# EAGLE design BusPirate-Breakout (EAGLE 5.10)
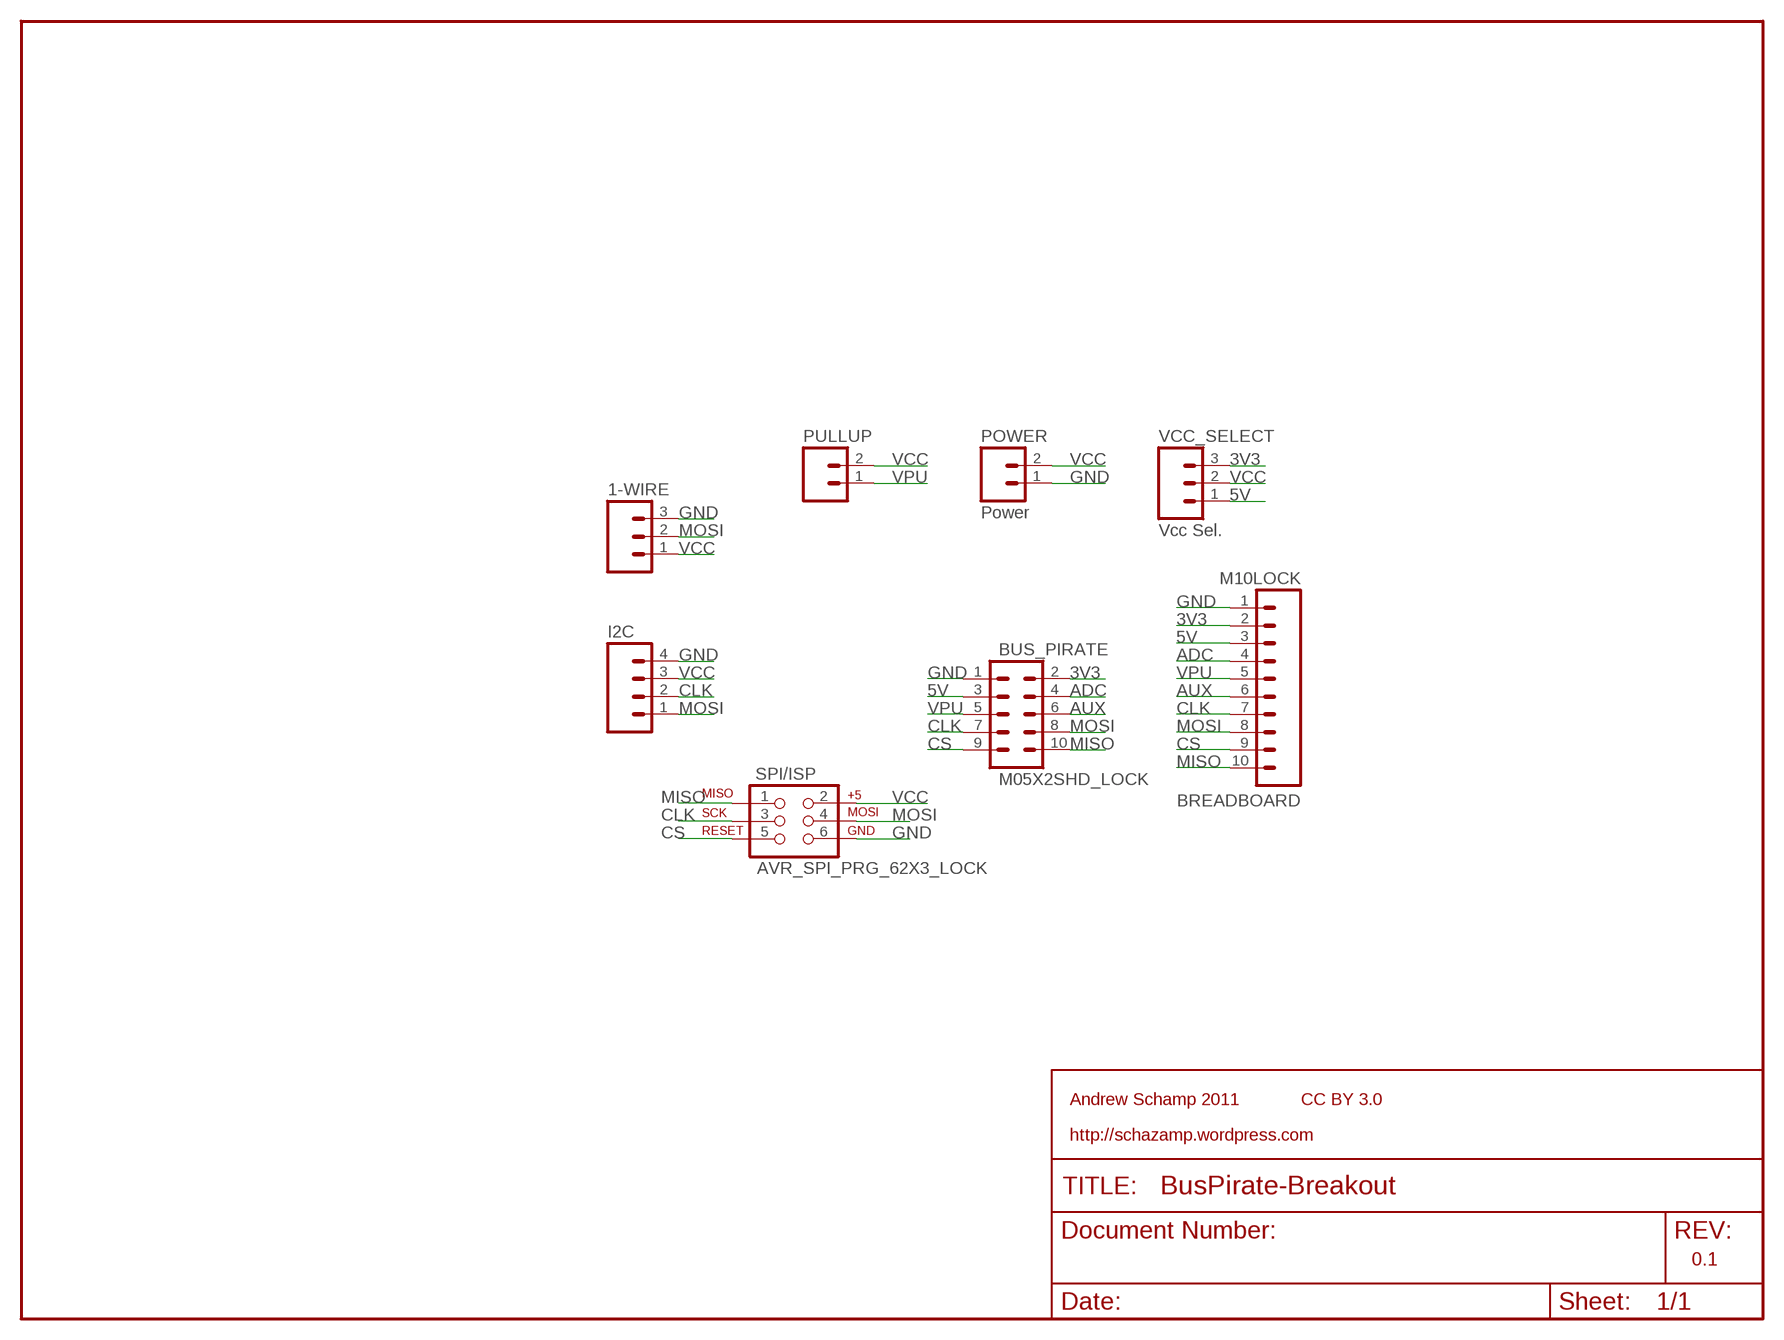
[diagram p0: schematic, sheet 1]

## Parts
1-WIRE  M03LOCK  [1X03_LOCK]
BREADBOARD  M10LOCK  [1X10_LOCK]
BUS_PIRATE  M05X2SHD_LOCK  [2X5-LOCK]
I2C  M04LOCK  [1X04_LOCK]
POWER  Power  M02LOCK  [1X02_LOCK]
PULLUP  M02LOCK  [1X02_LOCK]
SPI/ISP  AVR_SPI_PRG_62X3_LOCK  [2X3_LOCK]
VCC_SELECT  Vcc Sel.  M03LOCK  [1X03_LOCK]

## Nets
3V3: BREADBOARD.2 BUS_PIRATE.2 VCC_SELECT.3
5V: BREADBOARD.3 BUS_PIRATE.3 VCC_SELECT.1
ADC: BREADBOARD.4 BUS_PIRATE.4
AUX: BREADBOARD.6 BUS_PIRATE.6
CLK: BREADBOARD.7 BUS_PIRATE.7 I2C.2 SPI/ISP.3
CS: BREADBOARD.9 BUS_PIRATE.9 SPI/ISP.5
GND: 1-WIRE.3 BREADBOARD.1 BUS_PIRATE.1 I2C.4 POWER.1 SPI/ISP.6
MISO: BREADBOARD.10 BUS_PIRATE.10 SPI/ISP.1
MOSI: 1-WIRE.2 BREADBOARD.8 BUS_PIRATE.8 I2C.1 SPI/ISP.4
VCC: 1-WIRE.1 I2C.3 POWER.2 PULLUP.2 SPI/ISP.2 VCC_SELECT.2
VPU: BREADBOARD.5 BUS_PIRATE.5 PULLUP.1

## Notes on the sheet
- Andrew Schamp 2011 | CC BY 3.0
- http://schazamp.wordpress.com
- 0.1

## Library data of the parts
1-WIRE VCC_SELECT = SparkFun:M03: Header 3 Standard 3-pin 0.1" header. Use with straight break away headers (SKU : PRT-00116), right angle break away headers (PRT-00553), swiss pins (PRT-00743), machine pins (PRT-00117), and female headers (PRT-00115). Molex polarized connector foot print use with SKU : PRT-08232 with associated crimp pins and housings.
BREADBOARD = SparkFun:M10: Header 10 Standard 10-pin 0.1" header. Use with straight break away headers (SKU : PRT-00116), right angle break away headers (PRT-00553), swiss pins (PRT-00743), machine pins (PRT-00117), and female headers (PRT-00115).
BUS_PIRATE = ideabot:M05X2: Header 5x2 Standard 10-pin dual row 0.1" header. Commonly used with AVR-ISP. Use with Spark Fun Electronics SKU: PRT-00778
I2C = SparkFun:M04: Header 4 Standard 4-pin 0.1" header. Use with straight break away headers (SKU : PRT-00116), right angle break away headers (PRT-00553), swiss pins (PRT-00743), machine pins (PRT-00117), and female headers (PRT-00115). Molex polarized connector foot print use with SKU : PRT-08231 with associated crimp pins and housings.
POWER PULLUP = SparkFun:M02: Header 2 Standard 2-pin 0.1" header. Use with straight break away headers (SKU : PRT-00116), right angle break away headers (PRT-00553), swiss pins (PRT-00743), machine pins (PRT-00117), and female headers (PRT-00115). Molex polarized connector foot print use with SKU : PRT-08233 with associated crimp pins and housings.
SPI/ISP = SparkFun:AVR_SPI_PRG_6: AVR ISP 6 Pin This is the reduced ISP connector for AVR programming. Common on Arduino. This footprint will take up less PCB space and can be used with a 10-pin to 6-pin adapter such as SKU: BOB-08508

## Board
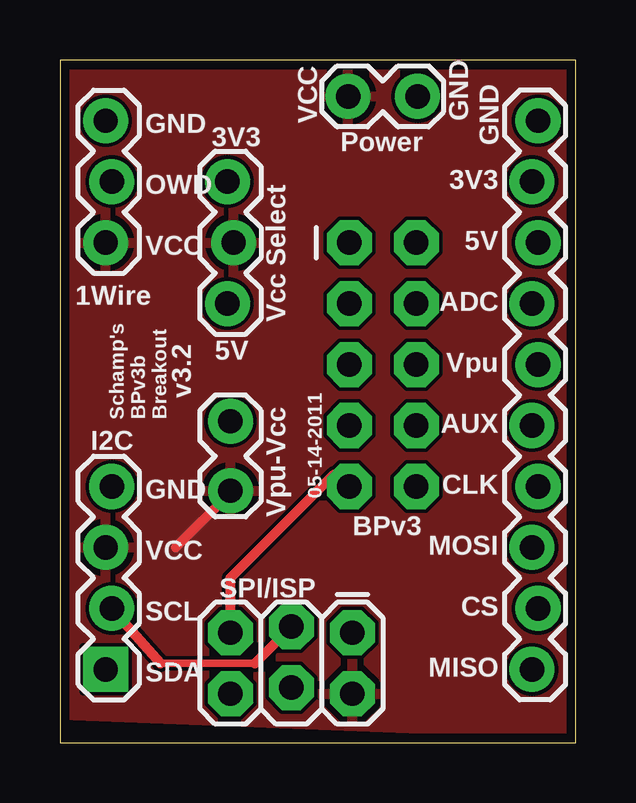
[diagram p1: board, top side]
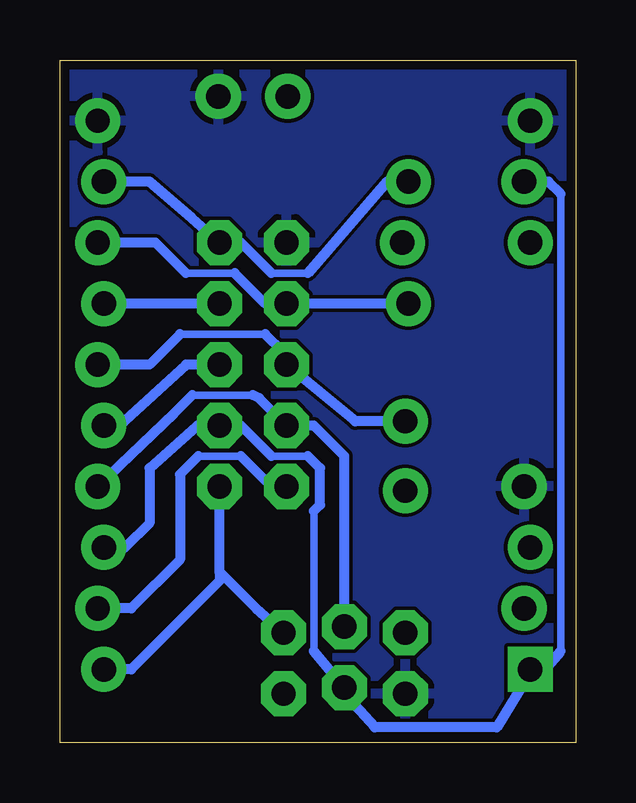
[diagram p2: board, bottom side, seen from below]

Size 21.51 x 28.44 mm. Coordinates in mm from the lower left corner, seen from the top.
Outline: 0,0 21.51,0 21.51,28.44 0,28.44 0,0
Copper layers (1*16): Top 0.0356mm / dielectric 1.5011mm / Bottom 0.0356mm
Design rules "LaenPCBOrder": minimum track width 6mil, minimum drill 13mil, track to track 6mil, track to pad 6mil, pad to pad 6mil, via to via 6mil, smd to smd 6mil, copper to edge 15mil, drill to drill 6mil, minimum pad ring 7mil, minimum via ring 7mil, stop-mask expansion 4mil, vias tented up to drill 0mil, thermal gap 10mil

### Footprints (pad centres in the part's own frame; a part is rotated, then mirrored left to right if it is on the bottom)
1X03_LOCK = drill 1.016 pad 1.88 round: 1 0,0.127; 2 2.54,-0.127; 3 5.08,0.127
1X10_LOCK = drill 1.016 pad 1.88 round: 1 0,0.127; 2 2.54,-0.127; 3 5.08,0.127; 4 7.62,-0.127; 5 10.16,0.127; 6 12.7,-0.127; 7 15.24,0.127; 8 17.78,-0.127; 9 20.32,0.127; 10 22.86,-0.127
2X5-LOCK = drill 1.016 pad 1.88 octagon: 1 -1.397,5.08; 2 1.397,5.08; 3 -1.397,2.54; 4 1.397,2.54; 5 -1.397,0; 6 1.397,0; 7 -1.397,-2.54; 8 1.397,-2.54; 9 -1.397,-5.08; 10 1.397,-5.08
1X04_LOCK = drill 1.016 pad 1.88 square: 1 0,0.127 | drill 1.016 pad 1.88 round: 2 2.54,-0.127; 3 5.08,0.127; 4 7.62,-0.127
1X02_LOCK = drill 1.016 pad 1.88 round: 1 -0.178,0; 2 2.718,0
2X3_LOCK = drill 1.016 pad 1.88 octagon: 1 0,0; 2 0,2.54; 3 2.54,-0.254; 4 2.54,2.286; 5 5.08,0; 6 5.08,2.54

### Placement (x,y rotation side)
1-WIRE  2.03,20.83 90 top
BREADBOARD  19.81,25.91 270 top
BUS_PIRATE  13.46,15.75 0 top
I2C  2.03,3.05 90 top
POWER  14.73,26.92 180 top
PULLUP  7.11,13.21 270 top
SPI/ISP  12.19,4.57 180 top
VCC_SELECT  7.11,18.29 90 top

### Tracks (layer width: path | path; a pad name or v marks a point on that pad's centre or on a via)
3V3
  Bottom 0.305: 11.18,19.56 12.7,19.56
  Bottom 0.406: BREADBOARD.2 17.78,23.37 16,21.84 BUS_PIRATE.2 13.97,20.83 12.7,19.56 | 11.18,19.56 7.87,23.37 VCC_SELECT.3
5V
  Bottom 0.305: 14.22,19.56 16.26,19.56
  Bottom 0.406: 14.22,19.56 12.95,18.29 BUS_PIRATE.3 VCC_SELECT.1 | 16.26,19.56 17.53,20.83 BREADBOARD.3
ADC
  Bottom 0.406: BUS_PIRATE.4 BREADBOARD.4
AUX
  Bottom 0.406: BUS_PIRATE.6 16.26,15.75 19.05,13.21 BREADBOARD.6
CLK
  Top 0.305: 4.19,3.3 8.13,3.3
  Top 0.406: 8.13,3.3 SPI/ISP.3 | I2C.2 4.19,3.3
  Bottom 0.305: 13.46,14.48 16,14.48
  Bottom 0.406: 16,14.48 16.76,13.72 BREADBOARD.7 | SPI/ISP.3 9.65,11.94 10.92,13.21 BUS_PIRATE.7 13.21,14.35 13.46,14.48
CS
  Top 0.406: BUS_PIRATE.9 11.43,11.18 7.11,6.86 SPI/ISP.5
  Bottom 0.305: 13.97,11.94 15.75,11.94
  Bottom 0.406: BUS_PIRATE.9 12.95,10.92 13.97,11.94 | 15.75,11.94 16.51,11.18 16.51,7.62 18.54,5.59 BREADBOARD.9
GND
  pour Bottom: 0,30.23 -1.27,19.18 0,1.4 0,-0.38 25.4,-0.38 25.65,29.97
MISO
  Bottom 0.406: 14.86,7.11 14.86,6.73 18.54,3.05 BREADBOARD.10 | 14.86,7.11 BUS_PIRATE.10 | SPI/ISP.1 13.34,5.59 14.86,7.11
MOSI
  Bottom 0.305: 11.18,11.94 12.7,11.94 | 0.64,3.81 0.64,22.86 | 10.92,3.81 10.92,9.65
  Bottom 0.406: BREADBOARD.8 18.8,8.13 17.78,9.14 17.78,11.43 15.62,13.34 BUS_PIRATE.8 13.97,13.21 12.7,11.94 | 11.18,11.94 10.67,11.43 10.67,9.91 10.92,9.65 | 1-WIRE.2 1.14,23.37 0.64,22.86 | 0.64,3.81 1.27,3.05 I2C.1 1.91,2.92 3.3,0.64 8.38,0.64 9.65,2.03 SPI/ISP.4 10.92,3.81
VCC
  Top 0.406: PULLUP.2 7.11,10.41 4.83,8.13
  pour Top: 0,29.34 22.61,28.45 22.61,0.25 0,1.14
VPU
  Bottom 0.305: 12.95,17.02 16.51,17.02
  Bottom 0.406: 12.95,17.02 12.19,16.26 BUS_PIRATE.5 9.2,13.39 PULLUP.1 | 16.51,17.02 17.78,15.75 BREADBOARD.5

### Text on the board
tNames: VCC | 3V3 | GND | GND | Power | GND | 3V3 | OWD | 5V | VCC | 1Wire | ADC | Vcc Select | 5V | Vpu | v3.2 | AUX | Schamp's | BPv3b | Breakout | I2C | CLK | GND | 05-14-2011 | Vpu-Vcc | BPv3 | MOSI | VCC | SPI/ISP | CS | SCL | MISO | SDA